# EAGLE schematic mainboard (EAGLE 7.7.0)
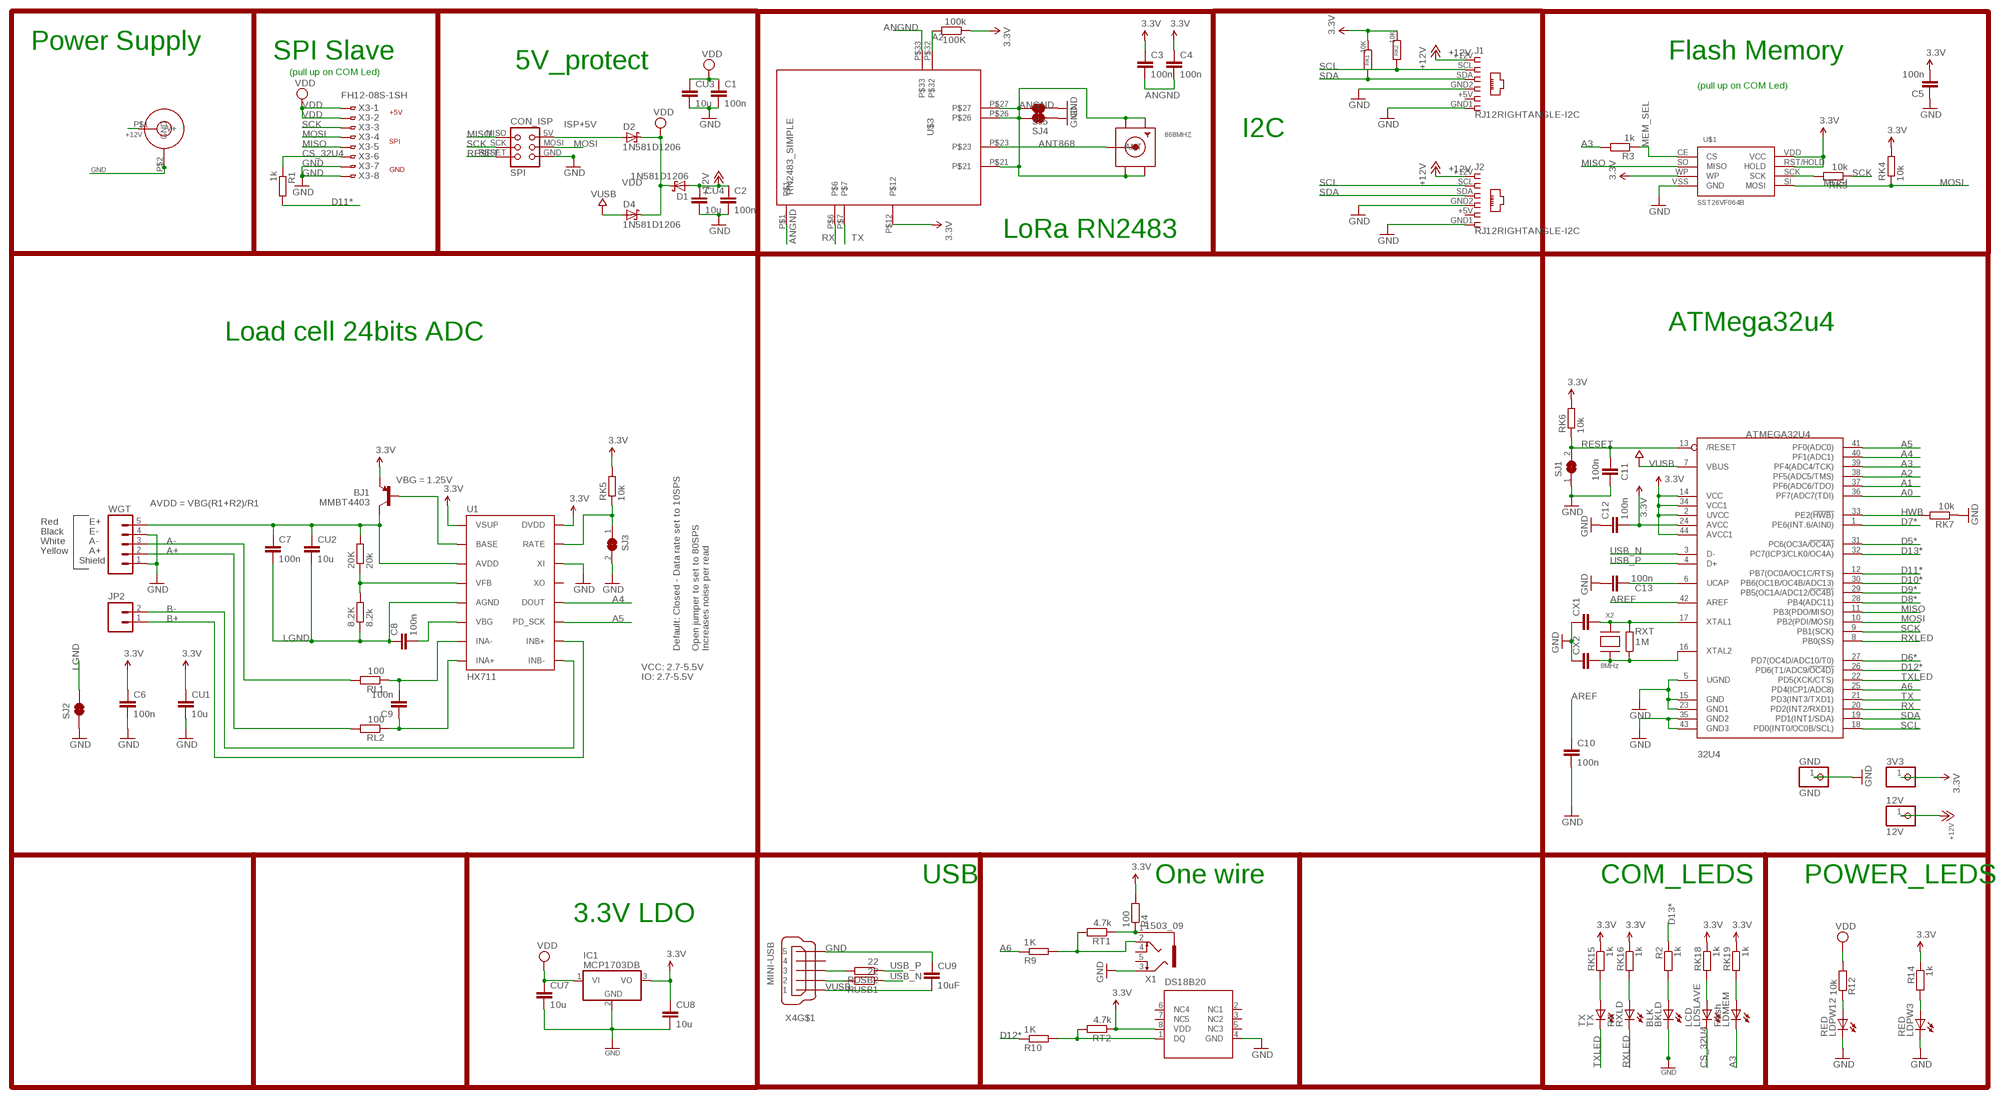
[diagram p0: schematic, sheet 1]

## Parts
3V3  PINHD-1X1  [1X01]
8.2K  8.2k  R-EU_M0805  [M0805]
12V  12V  PINHD-1X1  [1X01]
20K  20k  R-EU_M0805  [M0805]
32U4  ATMEGA32U4  ATMEGA32U4-AU  [TQFP44]
100K  100k  R-EU_R0805  [R0805]
868MHZ  SMACONNECTOR_EDGE_UFL  [SMA_EDGELAUNCH_UFL]
BJ1  MMBT4403  TRANSISTOR_PNPMMBT4403  [SOT23-3]
BKLD  BLK  LEDCHIP-LED0805  [CHIP-LED0805]
C1  100n  C-EUC0805  [C0805]
C2  100n  C-EUC0805  [C0805]
C3  100n  C-EUC0805  [C0805]
C4  100n  C-EUC0805  [C0805]
C5  100n  C-EUC0805  [C0805]
C6  100n  C-EUC0805  [C0805]
C7  100n  C-EUC0805  [C0805]
C8  100n  C-EUC0805  [C0805]
C9  100n  C-EUC0805  [C0805]
C10  100n  C-EUC0805  [C0805]
C11  100n  C-EUC0805  [C0805]
C12  100n  C-EUC0805  [C0805]
C13  100n  C-EUC0805  [C0805]
CON1  JACK_DC_BARREL  [DC_BARREL]
CON_ISP  SPI  TINYISPT  [TC2030-MCP-NL]
CU1  10u  C-EUC0805  [C0805]
CU2  10u  C-EUC0805  [C0805]
CU3  10u  C-EUC0805  [C0805]
CU4  10u  C-EUC0805  [C0805]
CU7  10u  C-EUC0805  [C0805]
CU8  10u  C-EUC0805  [C0805]
CU9  10uF  C-EUC0805  [C0805]
CX1  22pF  C-EUC0805  [C0805]
CX2  22pF  C-EUC0805  [C0805]
D1  1N581D1206  [LED-1206]
D2  1N581D1206  [LED-1206]
D4  1N581D1206  [LED-1206]
GND  GND  PINHD-1X1  [1X01]
IC1  MCP1703DB  [SOT223]
J1  RJ12RIGHTANGLE-I2C  [RJ12-RIGHTANGLE-I2C]
J2  RJ12RIGHTANGLE-I2C  [RJ12-RIGHTANGLE-I2C]
JP2  M02PTH  [1X02]
LDMEM  Flash  LEDCHIP-LED0805  [CHIP-LED0805]
LDPW3  RED  LEDCHIP-LED0805  [CHIP-LED0805]
LDPW12  RED  LEDCHIP-LED0805  [CHIP-LED0805]
LDSLAVE  LCD  LEDCHIP-LED0805  [CHIP-LED0805]
R1  1k  R-EU_R0805  [R0805]
R2  1k  R-EU_R0805  [R0805]
R3  1k  R-EU_R0805  [R0805]
R4  100  R-EU_R0805  [R0805]
R9  1K  R-EU_R0805  [R0805]
R10  1K  R-EU_R0805  [R0805]
R12  10k  R-EU_R0805  [R0805]
R14  1k  R-EU_R0805  [R0805]
RK1  10K  R-EU_M0805  [M0805]
RK2  10K  R-EU_M0805  [M0805]
RK3  10k  R-EU_R0805  [R0805]
RK4  10k  R-EU_R0805  [R0805]
RK5  10k  R-EU_M0805  [M0805]
RK6  10k  R-EU_M0805  [M0805]
RK7  10k  R-EU_M0805  [M0805]
RK15  1k  R-EU_R0805  [R0805]
RK16  1k  R-EU_R0805  [R0805]
RK18  1k  R-EU_R0805  [R0805]
RK19  1k  R-EU_R0805  [R0805]
RL1  100  R-EU_M0805  [M0805]
RL2  100  R-EU_M0805  [M0805]
RT1  4.7k  R-EU_R0805  [R0805]
RT2  4.7k  R-EU_R0805  [R0805]
RUSB1  22  R-EU_M0805  [M0805]
RUSB2  22  R-EU_M0805  [M0805]
RXLD  RX  LEDCHIP-LED0805  [CHIP-LED0805]
RXT  1M  R-EU_R0805  [R0805]
SJ1  SJ  [SJ]
SJ2  JUMPER-PAD-2-NC_BY_TRACE  [PAD-JUMPER-2-NC_BY_TRACE_YES_SILK]
SJ3  SJ  [SJ]
SJ4  JUMPER-PAD-2-NC_BY_TRACE  [PAD-JUMPER-2-NC_BY_TRACE_YES_SILK]
SJ5  JUMPER-PAD-2-NC_BY_TRACE  [PAD-JUMPER-2-NC_BY_TRACE_YES_SILK]
TX  TX  LEDCHIP-LED0805  [CHIP-LED0805]
U1  HX711  HX711HX711  [SO16]
U$1  SST26VF064B  SST25VF064C  [SOIC_8-LEAD]
U$2  DS18B20  DS18B20SMALL  [MSOP8]
U$3  RN2483_SIMPLE  [RN2483_SIMPLE]
WGT  M05PTH  [1X05]
X1  1503_09  [1503_09]
X2  8MHz  XTALNX6035  [NX6035]
X3  FH12-08S-1SH  [FH12-08S-1SH]
X4  MINI-USB  MINI-USB-SCHIELD-32005-201  [32005-201]

## Nets
3.3V [power]: 3V3.1 32U4.2(UVCC) 32U4.14(VCC) 32U4.24(AVCC) 32U4.34(VCC1) 32U4.44(AVCC1) 100K.1 BJ1.2(E) C3.1 C4.1 C5.2 C6.1 C12.2 CU1.1 CU8.1 IC1.3(VO) R4.2 R14.1 RK1.1 RK2.1 RK4.2 RK5.2 RK6.2 RK15.1 RK16.1 RK18.1 RK19.1 RT2.1 U1.1(VSUP) U1.16(DVDD) U$1.RST/HOLD(HOLD) U$1.VDD(VCC) U$1.WP U$2.8(VDD) U$3.P$12
+12V [power]: 12V.1 C2.1 CON1.P$1(V+) CU4.1 D1.A J1.+12V J2.+12V
A0: 32U4.36(PF7(ADC7(TDI))
A1: 32U4.37(PF6(ADC6/TDO))
A2: 32U4.38(PF5(ADC5/TMS)) 100K.2 U$3.P$32
A3: 32U4.39(PF4(ADC4/TCK)) LDMEM.C R3.2
A4: 32U4.40(PF1(ADC1)) U1.12(DOUT)
A5: 32U4.41(PF0(ADC0)) U1.11(PD_SCK)
A6: 32U4.25(PD4(ICP1/ADC8)) R9.1
A+: RL2.2 WGT.2
A-: RL1.2 WGT.3
ANGND: 868MHZ.GND@1(GND1) 868MHZ.GND@2(GND2) 868MHZ.GND@3(GND3) 868MHZ.GND@4(GND4) C3.2 C4.2 SJ4.2 SJ5.2 U$3.P$1 U$3.P$21 U$3.P$26 U$3.P$27 U$3.P$33
ANT868: 868MHZ.P(ANT) U$3.P$23
AREF: 32U4.42(AREF) C10.1
B+: JP2.1 U1.10(INB+)
B-: JP2.2 U1.9(INB-)
CN3: C8.2 U1.6(VBG)
CS_32U4: LDSLAVE.C R1.1 X3.6
D5*: 32U4.31(PC6(OC3A/!OC4A))
D6*: 32U4.27(PD7(OC4D/ADC10/T0))
D7*: 32U4.1(PE6(INT.6/AIN0))
D8*: 32U4.28(PB4(ADC11))
D9*: 32U4.29(PB5(OC1A/ADC12/!OC4B))
D10*: 32U4.30(PB6(OC1B/OC4B/ADC13))
D11*: 32U4.12(PB7(OC0A/OC1C/RTS)) R1.2
D12*: 32U4.26(PD6(T1/ADC9/!OC4D)) R10.1
D13*: 32U4.32(PC7(ICP3/CLK0/OC4A)) R2.1
GND [power]: 32U4.5(UGND) 32U4.15(GND) 32U4.23(GND1) 32U4.35(GND2) 32U4.43(GND3) BKLD.C C1.2 C2.2 C5.1 C6.2 C10.2 C11.2 C12.1 C13.1 CON1.P$2(GND) CON_ISP.GND CU1.2 CU3.2 CU4.2 CU7.2 CU8.2 CU9.1 CX1.1 CX2.1 GND.1 IC1.2(GND) J1.GND1 J1.GND2 J2.GND1 J2.GND2 LDPW3.C LDPW12.C RK7.1 SJ1.1 SJ2.1 SJ3.2 SJ4.1 SJ5.1 U1.14(XI) U$1.VSS(GND) U$2.4(GND) WGT.1 WGT.4 X1.3 X3.7 X3.8 X4.5
HWB: 32U4.33(PE2(!HWB)) RK7.2
ISP+5V: CON_ISP.5V(VCC) D2.A
LGND: 8.2K.1 C7.2 C8.1 CU2.2 SJ2.2 U1.5(AGND)
MEM_SEL: R3.1 U$1.CE(CS)
MISO: 32U4.11(PB3(PDO/MISO)) CON_ISP.MISO U$1.SO(MISO) X3.5
MOSI: 32U4.10(PB2(PDI/MOSI)) CON_ISP.MOSI RK4.1 U$1.SI(MOSI) X3.4
N$1: 32U4.6(UCAP) C13.2
N$3: BKLD.A R2.2
N$5: 20K.2 BJ1.3(C) C7.1 CU2.1 U1.3(AVDD) WGT.5
N$7: LDPW12.A R12.1
N$9 [power]: R10.2 RT2.2 U$2.1(DQ)
N$14 [power]: R4.1 RT1.1 X1.1
N$18: RK15.2 TX.A
N$20: C9.2 RL1.1 U1.7(INA-)
N$21 [power]: R9.2 RT1.2 X1.2
N$22: LDSLAVE.A RK18.2
N$23: RK3.2 U$1.SCK
N$24: RK16.2 RXLD.A
N$25: LDMEM.A RK19.2
N$34: LDPW3.A R14.2
N$38: BJ1.1(B) U1.2(BASE)
N$39: 8.2K.2 20K.1 U1.4(VFB)
N$41: RK5.1 SJ3.1 U1.15(RATE)
N$42: 32U4.17(XTAL1) CX1.2 RXT.2 X2.P$2
N$43: C9.1 RL2.1 U1.8(INA+)
RESET: 32U4.13(/RESET) C11.1 CON_ISP.RESET RK6.1 SJ1.2
RX: 32U4.20(PD2(INT2/RXD1)) U$3.P$6
RXLED: 32U4.8(PB0(SS)) RXLD.C
SCK: 32U4.9(PB1(SCK)) CON_ISP.SCK RK3.1 X3.3
SCL: 32U4.18(PD0(INT0/OC0B/SCL)) J1.SCL J2.SCL RK2.2
SDA: 32U4.19(PD1(INT1/SDA)) J1.SDA J2.SDA RK1.2
TX: 32U4.21(PD3(INT3/TXD1)) U$3.P$7
TXLED: 32U4.22(PD5(XCK/CTS)) TX.C
USB_N: 32U4.3(D-) RUSB1.1
USB_P: 32U4.4(D+) RUSB2.1
USBC_N: RUSB1.2 X4.2
USBC_P: RUSB2.2 X4.3
VDD [power]: C1.1 CU3.1 CU7.1 D1.C D2.C D4.C IC1.1(VI) R12.2 X3.1 X3.2
VUSB: 32U4.7(VBUS) CU9.2 D4.A X4.1
XTAL1: 32U4.16(XTAL2) CX2.2 RXT.1 X2.P$1
Unconnected: U1.13(XO) U$2.2(NC1) U$2.3(NC2) U$2.5(NC3) U$2.6(NC4) U$2.7(NC5) X1.4 X1.5 X4.4 X4.M1(S:S1) X4.M2(S:S2) X4.M3(S:S3) X4.M4(S:S4)

## Notes on the sheet
- Power Supply
- SPI Slave | Flash Memory
- 5V_protect
- (pull up on COM Led)
- (pull up on COM Led)
- +5V
- I2C
- SPI
- GND
- LoRa RN2483
- ATMega32u4
- Load cell 24bits ADC
- VBG = 1.25V
- AVDD = VBG(R1+R2)/R1
- Red | E+
- Black | E-
- White | A-
- Yellow | A+
- Shield
- Default: Closed - Data rate set to 10SPS
- Open jumper to set to 80SPS
  Increases noise per read
- VCC: 2.7-5.5V
- IO: 2.7-5.5V
- USB | One wire | COM_LEDS | POWER_LEDS
- 3.3V LDO

## Power pins joined to a net without a drawn wire
5: J1.+5V J2.+5V

## Library data of the parts
3V3 12V GND = Headerlibrary:PINHD-1X1: PIN HEADER
8.2K 20K R14 RK1 RK2 RK5-RK7 RL1 RL2 RT1 RT2 RUSB1 RUSB2 = resistor:R-EU_: RESISTOR, European symbol
32U4 = adafruit:ATMEGA32U4: http://www.ladyada.net/library/eagle
100K R1-R4 R9 R10 R12 RK3 RK4 RK15 RK16 RK18 RK19 RXT = rcl:R-EU_: RESISTOR, European symbol
868MHZ = sma_end_launch:SMACONNECTOR: SMA Connector 90° DIP SMA Connector, 50 Ohm (4UConnector: 07259)
BJ1 = SparkFun-DiscreteSemi:TRANSISTOR_PNP: Generic PNP BJT Double check pinouts against datasheets- not all devices are the same! MMBT3906 - 40V 200mA SOT-23 (TRANS-08052) MMBT4403 - 40V 600mA SOT-23 (TRANS-09245); PROD_ID: TRANS-09245
BKLD LDMEM LDPW3 LDPW12 LDSLAVE RXLD TX = adafruit:LED: LED OSRAM: - CHIPLED LG R971, LG N971, LY N971, LG Q971, LY Q971, LO R971, LY R971 LH N974, LH R974 LS Q976, LO Q976, LY Q976 LO Q996 - Hyper CHIPLED LW Q18S LB Q993, LB Q99A, LB R99A - SideLED LS A670, LO A670, LY A670, LG A670, LP A670 LB A673, LV A673, LT A673, LW A673 LH A674 LY A675 LS A676, LA A676, LO A676, LY A676, LW A676 LS A679, LY A679, LG A679 - Hyper Micro SIDELED® LS Y876, LA Y876, LO Y876, LY Y876 LT Y87S - SmartLED LW L88C, LW L88S LB L89C, LB L89S, LG L890 LS L89K, LO L89K, LY L89K LS L896, LA L896, LO L896, LY L896 - TOPLED LS T670, LO T670, LY T670, LG T670, LP T670 LSG T670, LSP T670, LSY T670, LOP T670, LYG T670 LG T671, LOG T671, LSG T671 LB T673, LV T673, LT T673, LW T673 LH T674 LS T676, LA T676, LO T676, LY T676, LB T676, LH T676, LSB T676, LW T676 LB T67C, LV T67C, LT T67C, LS T67K, LO T67K, LY T67K, LW E67C LS E67B, LA E67B, LO E67B, LY E67B, LB E67C, LV E67C, LT E67C LW T67C LS T679, LY T679, LG T679 LS T770, LO T770, LY T770, LG T770, LP T770 LB T773, LV T773, LT T773, LW T773 LH T774 LS E675, LA E675, LY E675, LS T675 LS T776, LA T776, LO T776, LY T776, LB T776 LHGB T686 LT T68C, LB T68C - Hyper Mini TOPLED® LB M676 - Mini TOPLED Santana® LG M470 LS M47K, LO M47K, LY M47K Source: http://www.osram.convergy.de/
C1-C13 CU1-CU4 CU7-CU9 CX1 CX2 = rcl:C-EU: CAPACITOR, European symbol
CON1 = lpatiny:JACK_DC_BARREL
CON_ISP = lpatiny:TINYISP: CONNECTOR
D1 D2 D4 = lpatiny:1N581*: 1.0A SCHOTTKY BARRIER RECTIFIER Source: http://www.diodes.com/datasheets/ds23001.pdf
IC1 = linear:MCP1703: 250 mA, 16V, Low Quiescent Current LDO Regulator Source: http://ww1.microchip.com/downloads/en/DeviceDoc/22049b.pdf
J1 J2 = lpatiny:RJ12: CORCOM Modular RJ Jacks No Shield Source: www.tycoelectronics.com .. ENG_DS_1654001_1099_RJ_L_0507.pdf
JP2 = SparkFun-Connectors:M02: Standard 2-pin 0.1" header. Use with - straight break away headers ( PRT-00116) - right angle break away headers (PRT-00553) - swiss pins (PRT-00743) - machine pins (PRT-00117) - female headers (PRT-00115) Molex polarized connector foot print use with: PRT-08233 with associated crimp pins and housings. 2.54_SCREWTERM for use with PRT-10571. 3.5mm Screw Terminal footprints for PRT-08084 5mm Screw Terminal footprints for use with PRT-08432
SJ1 SJ3 = jumper:SJ: SMD solder JUMPER
SJ2 SJ4 SJ5 = SparkFun-Passives:JUMPER-PAD-2-NC_BY_TRACE
U1 = Testing:HX711; PROD_ID: IC-12445
U$1 = BertaLib:SST25VF064C
U$2 = lpatiny:DS18B20
U$3 = Octanis1_bioreactorPort:RN2483_SIMPLE
WGT = SparkFun-Connectors:M05: Header 5 Standard 5-pin 0.1" header. Use with straight break away headers (SKU : PRT-00116), right angle break away headers (PRT-00553), swiss pins (PRT-00743), machine pins (PRT-00117), and female headers (PRT-00115). Molex polarized connector foot print use with SKU : PRT-08230 with associated crimp pins and housings.
X1 = con-lumberg:1503_09: Jack connectors according to JISC 6560, 3.5 mm Klinkeneinbaukupplung nach JISC 6560, 3,5 mm, 3-polig/ stereo, abgewinkelte Ausführung, mit 2 Öffnern und Lötaugen, für Leiterplatten Rückseitenmontage Source: http://www.lumberg.com/Produkte/PDFs/1503_09.pdf; OC_FARNELL: 1243244; OC_NEWARK: unknown
X2 = lpatiny:XTAL: Low cost SMT crystals, no capacitors included http://www.ladyada.net/library/eagle
X3 = con-hirose:FH12-08S-1S: 1mm Pitch Connectors For FPC/FFC Source: Data sheet <http://www.hirose.co.jp/cataloge_hp/e58605370.pdf>; OC_FARNELL: unknown; OC_NEWARK: unknown
X4 = con-cypressindustries:MINI-USB-SCHIELD-: MINI USB-B Conector Source: www.cypressindustries.com; OC_FARNELL: unknown; OC_NEWARK: unknown

## Net classes
0 default: width 0.203 mm, clearance 0.25 mm
1 power: width 0.203 mm, drill 0.305 mm, clearance 0.25 mm
2 VIN: width 0.457 mm, clearance 0.25 mm
3 fine: width 0.254 mm, clearance 0.25 mm
4 aref: width 0.356 mm, clearance 0.25 mm